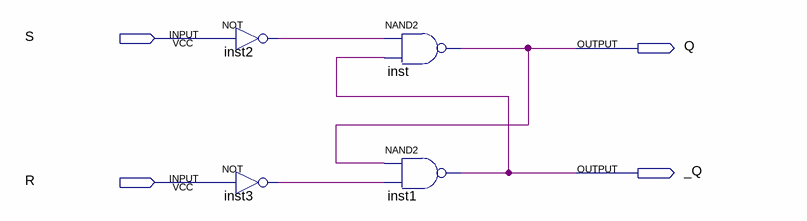
[diagram p0: schematic sheet]
// Quartus schematic ffrs.bdf as structural Verilog: 4 symbols, 4 pins
module ffrs (
  input  S,
  input  R,
  output Q,
  output _Q
);

  wire inst2_out, inst3_out;

  not inst2 (inst2_out, S);
  not inst3 (inst3_out, R);
  nand inst (Q, inst2_out, _Q);
  nand inst1 (_Q, Q, inst3_out);
endmodule
